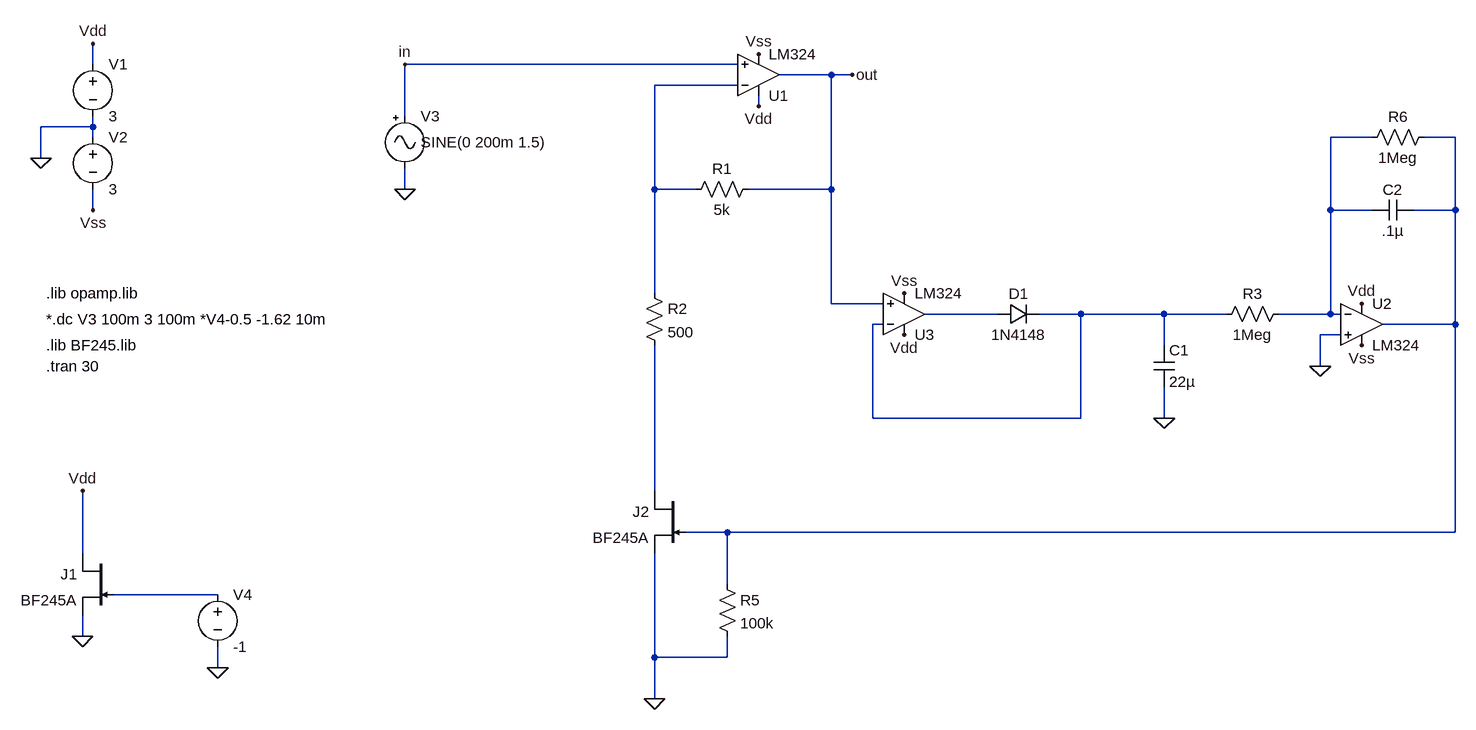
[diagram p0: schematic agc_1.asc]
agc_1.asc, the LTspice schematic file:
Version 4
SHEET 1 1464 940
WIRE -800 -160 -800 -192
WIRE 192 -160 -320 -160
WIRE 336 -144 256 -144
WIRE 368 -144 336 -144
WIRE 192 -128 64 -128
WIRE 224 -96 224 -112
WIRE -320 -80 -320 -160
WIRE -800 -64 -800 -80
WIRE -800 -64 -880 -64
WIRE -800 -48 -800 -64
WIRE 1168 -48 1104 -48
WIRE 1296 -48 1248 -48
WIRE -880 -16 -880 -64
WIRE -320 32 -320 0
WIRE 64 32 64 -128
WIRE 128 32 64 32
WIRE 336 32 336 -144
WIRE 336 32 208 32
WIRE -800 64 -800 32
WIRE 1104 64 1104 -48
WIRE 1168 64 1104 64
WIRE 1296 64 1296 -48
WIRE 1296 64 1232 64
WIRE 64 192 64 32
WIRE 336 208 336 32
WIRE 416 208 336 208
WIRE 592 224 480 224
WIRE 720 224 656 224
WIRE 848 224 720 224
WIRE 944 224 848 224
WIRE 1104 224 1104 64
WIRE 1104 224 1024 224
WIRE 1120 224 1104 224
WIRE 416 240 400 240
WIRE 1296 240 1296 64
WIRE 1296 240 1184 240
WIRE 1120 256 1088 256
WIRE 848 272 848 224
WIRE 1088 304 1088 256
WIRE 400 384 400 240
WIRE 720 384 720 224
WIRE 720 384 400 384
WIRE 848 384 848 336
WIRE 64 496 64 272
WIRE 176 560 112 560
WIRE 1296 560 1296 240
WIRE 1296 560 176 560
WIRE -816 592 -816 496
WIRE 176 640 176 560
WIRE -608 656 -768 656
WIRE -816 720 -816 688
WIRE 64 752 64 592
WIRE 176 752 176 720
WIRE 176 752 64 752
WIRE -608 768 -608 736
WIRE 64 816 64 752
FLAG -880 -16 0
FLAG -800 -192 Vdd
FLAG 224 -96 Vdd
FLAG -800 64 Vss
FLAG -320 32 0
FLAG 368 -144 out
FLAG -320 -160 in
FLAG -816 720 0
FLAG -816 496 Vdd
FLAG -608 768 0
FLAG 448 192 Vss
FLAG 448 256 Vdd
FLAG 64 816 0
FLAG 1152 208 Vdd
FLAG 1152 272 Vss
FLAG 1088 304 0
FLAG 848 384 0
FLAG 224 -176 Vss
SYMBOL voltage -800 -176 R0
SYMATTR InstName V1
SYMATTR Value 3
SYMBOL voltage -800 -64 R0
SYMATTR InstName V2
SYMATTR Value 3
SYMBOL Misc\\signal -320 -96 R0
WINDOW 123 24 144 Left 2
WINDOW 39 0 0 Left 2
WINDOW 3 24 56 Left 2
SYMATTR Value SINE(0 200m 1.5)
SYMATTR InstName V3
SYMBOL res 224 16 R90
WINDOW 0 0 56 VBottom 2
WINDOW 3 32 56 VTop 2
SYMATTR InstName R1
SYMATTR Value 5k
SYMBOL njf -768 592 M0
SYMATTR InstName J1
SYMATTR Value BF245A
SYMBOL voltage -608 640 R0
SYMATTR InstName V4
SYMATTR Value -1
SYMBOL Opamps\\opamp2 224 -80 M180
SYMATTR InstName U1
SYMATTR Value LM324
SYMBOL Opamps\\opamp2 448 288 M180
SYMATTR InstName U3
SYMATTR Value LM324
SYMBOL cap 832 272 R0
SYMATTR InstName C1
SYMATTR Value 22µ
SYMBOL njf 112 496 M0
SYMATTR InstName J2
SYMATTR Value BF245A
SYMBOL res 48 176 R0
SYMATTR InstName R2
SYMATTR Value 500
SYMBOL res 160 624 R0
SYMATTR InstName R5
SYMATTR Value 100k
SYMBOL Opamps\\opamp2 1152 176 R0
SYMATTR InstName U2
SYMATTR Value LM324
SYMBOL res 1040 208 R90
WINDOW 0 0 56 VBottom 2
WINDOW 3 32 56 VTop 2
SYMATTR InstName R3
SYMATTR Value 1Meg
SYMBOL cap 1232 48 R90
WINDOW 0 0 32 VBottom 2
WINDOW 3 32 32 VTop 2
SYMATTR InstName C2
SYMATTR Value .1µ
SYMBOL diode 592 240 R270
WINDOW 0 32 32 VTop 2
WINDOW 3 0 32 VBottom 2
SYMATTR InstName D1
SYMATTR Value 1N4148
SYMBOL res 1264 -64 R90
WINDOW 0 0 56 VBottom 2
WINDOW 3 32 56 VTop 2
SYMATTR InstName R6
SYMATTR Value 1Meg
TEXT -872 232 Left 2 !*.dc V3 100m 3 100m *V4-0.5 -1.62 10m
TEXT -872 192 Left 2 !.lib opamp.lib
TEXT -872 272 Left 2 !.lib BF245.lib
TEXT -872 304 Left 2 !.tran 30

The netlist it stands for:
* agc_1.asc
V1 Vdd 0 3
V2 0 Vss 3
V3 in 0 SINE(0 200m 1.5)
R1 out N001 5k
J1 Vdd N007 0 BF245A
V4 N007 0 -1
XU1 in N001 Vdd Vss out LM324  ; pins In+ In- V+ V- OUT
XU3 out N005 Vdd Vss N004 LM324  ; pins In+ In- V+ V- OUT
C1 N005 0 22µ
J2 N006 N003 0 BF245A
R2 N001 N006 500
R5 N003 0 100k
XU2 0 N002 Vdd Vss N003 LM324  ; pins In+ In- V+ V- OUT
R3 N002 N005 1Meg
C2 N003 N002 .1µ
D1 N004 N005 1N4148
R6 N003 N002 1Meg
.model D D
.lib standard.dio
.model NJF NJF
.model PJF PJF
.lib standard.jft
*.dc V3 100m 3 100m *V4-0.5 -1.62 10m
.lib opamp.lib
.lib BF245.lib
.tran 30
.backanno
.end